# EAGLE schematic Power Outlet-RevB (EAGLE 6.4)
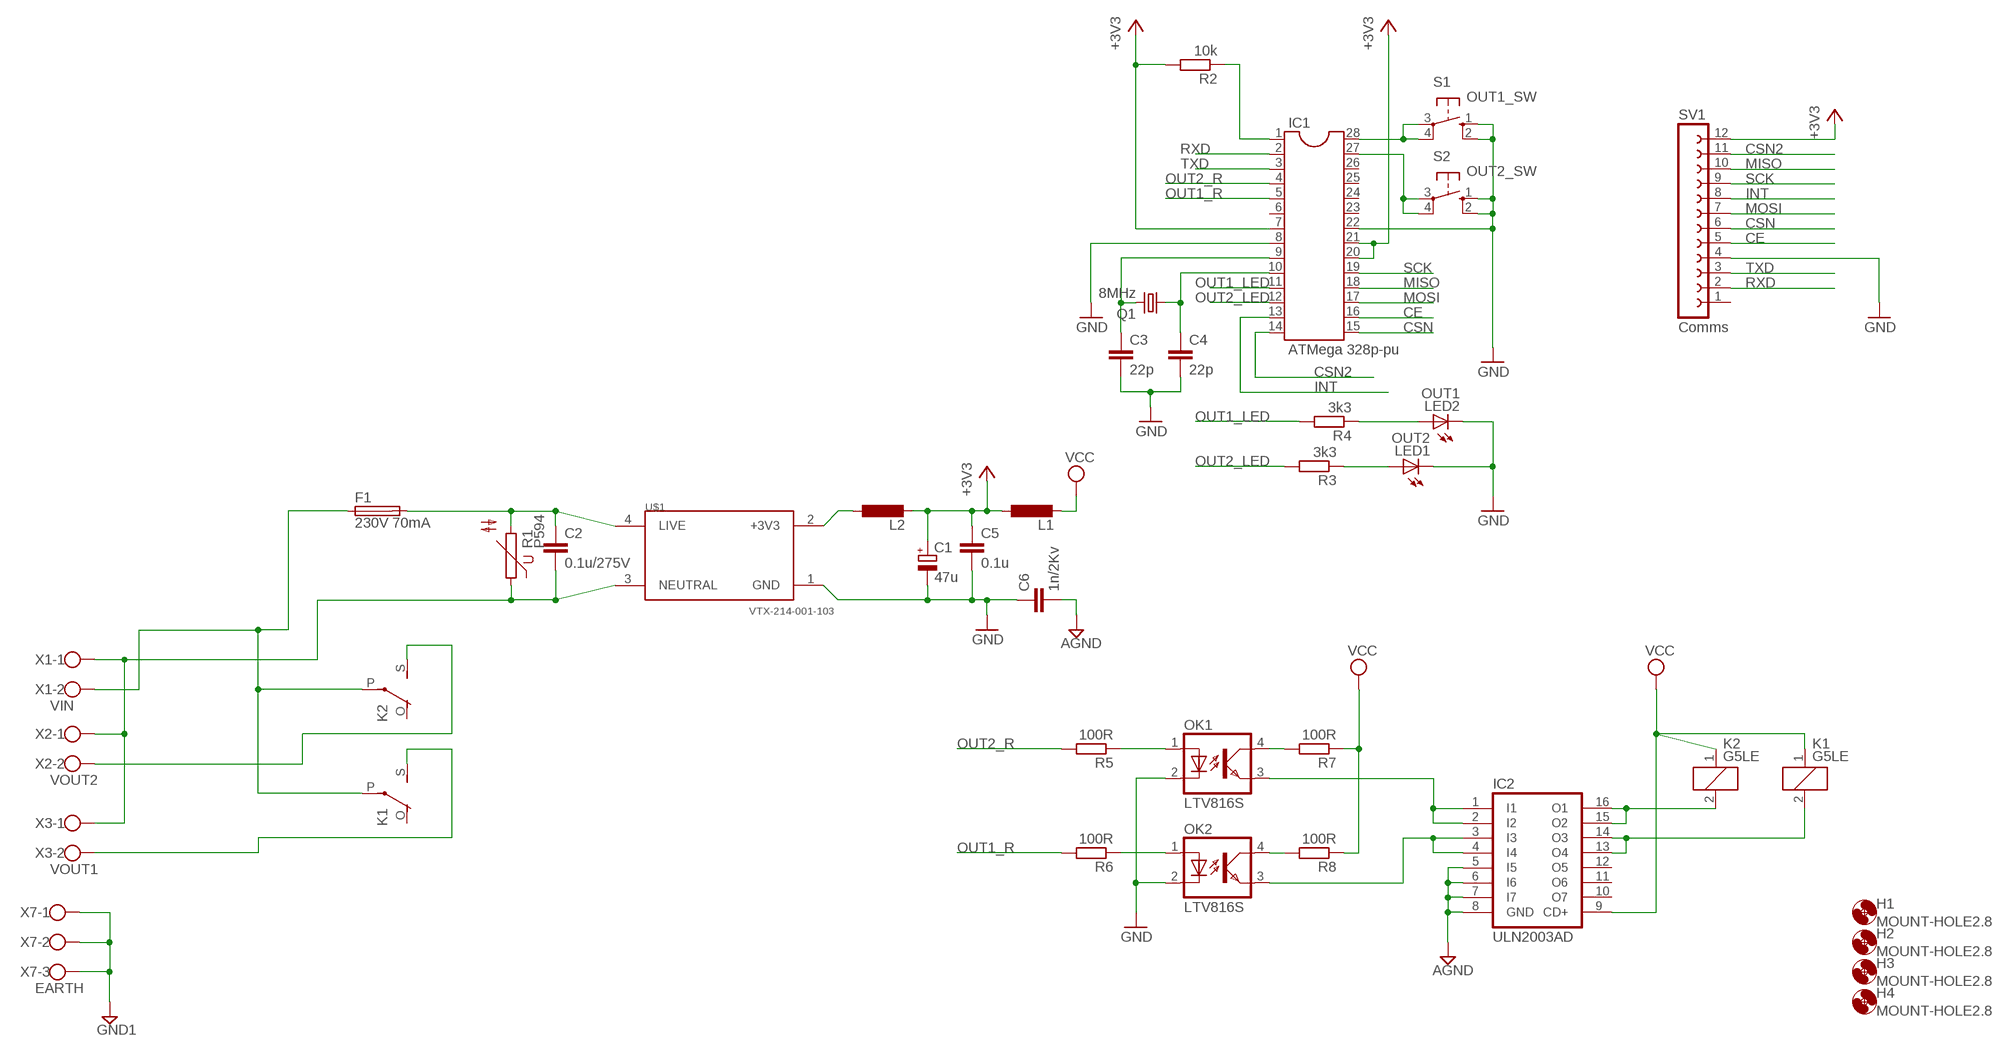
[diagram p0: schematic, sheet 1]

## Parts
C1  47u  CPOL-EUE2,5-6E  [E2,5-6E]
C2  0.1u/275V  C-EU050-030X075  [C050-030X075]
C3  22p  C-EUC1206K  [C1206K]
C4  22p  C-EUC1206K  [C1206K]
C5  0.1u  C-EUC1206K  [C1206K]
C6  1n/2Kv  C-EUC1206K  [C1206K]
F1  230V 70mA  FUSESH22,5A  [SH22,5A]
H1  MOUNT-HOLE2.8  [2,8]
H2  MOUNT-HOLE2.8  [2,8]
H3  MOUNT-HOLE2.8  [2,8]
H4  MOUNT-HOLE2.8  [2,8]
IC1  ATMega 328p-pu  DIL28-3  [DIL28-3]
IC2  ULN2003AD  [SO16]
K1  G5LE  [G5LE]
K2  G5LE  [G5LE]
L1  L-EUL3225P  [L3225P]
L2  L-EUL3225P  [L3225P]
LED1  OUT2  LED5MM  [LED5MM]
LED2  OUT1  LED5MM  [LED5MM]
OK1  LTV816S  [SMD4]
OK2  LTV816S  [SMD4]
Q1  8MHz  CRYSTALHC49S  [HC49/S]
R1  P594  [P594]
R2  10k  R-EU_R1206W  [R1206W]
R3  3k3  R-EU_R1206W  [R1206W]
R4  3k3  R-EU_R1206W  [R1206W]
R5  100R  R-EU_R1206W  [R1206W]
R6  100R  R-EU_R1206W  [R1206W]
R7  100R  R-EU_R1206W  [R1206W]
R8  100R  R-EU_R1206W  [R1206W]
S1  OUT1_SW  40-XX  [B3F-40XX]
S2  OUT2_SW  40-XX  [B3F-40XX]
SV1  Comms  FE12W  [FE12W]
U$1  VTX-214-001-103  [VTX214001103]
X1  VIN  W237-102  [W237-102]
X2  VOUT2  W237-102  [W237-102]
X3  VOUT1  W237-102  [W237-102]
X7  EARTH  W237-103  [W237-103]

## Nets
+3V3: C1.+ C5.1 IC1.7 IC1.20 IC1.21 L1.1 L2.1 L2.2 R2.2 SV1.12 U$1.2(+3V3)
AGND: C6.2 IC2.5(I5) IC2.6(I6) IC2.7(I7) IC2.8(GND)
CE: IC1.16 SV1.5
CSN: IC1.15 SV1.6
CSN2: IC1.14 SV1.11
GND: C1.- C3.2 C4.2 C5.2 C6.1 IC1.8 IC1.22 LED1.K(C) LED2.K(C) OK1.2(C) OK2.2(C) S1.1(S) S1.2(S1) S2.1(S) S2.2(S1) SV1.4 U$1.1(GND)
GND1: X7.1 X7.2 X7.3
INT: IC1.13 SV1.8
MISO: IC1.18 SV1.10
MOSI: IC1.17 SV1.7
N$1: F1.1 K1.P(2:P) K2.P(2:P) X1.2
N$2: C2.1 F1.2 R1.2 U$1.4(LIVE)
N$3: C2.2 R1.1 U$1.3(NEUTRAL) X1.1 X2.1 X3.1
N$4: IC1.1 R2.1
N$5: C3.1 IC1.9 Q1.2
N$6: C4.1 IC1.10 Q1.1
N$7: LED1.A R3.1
N$8: LED2.A R4.1
N$9: IC1.28 S1.3(P) S1.4(P1)
N$10: IC1.27 S2.3(P) S2.4(P1)
N$11: K2.S(2:S) X2.2
N$12: IC2.15(O2) IC2.16(O1) K2.2
N$13: IC2.13(O4) IC2.14(O3) K1.2
N$14: K1.S(2:S) X3.2
N$15: OK1.1(A) R5.1
N$16: OK2.1(A) R6.1
N$17: IC2.1(I1) IC2.2(I2) OK1.3(EMIT)
N$18: IC2.3(I3) IC2.4(I4) OK2.3(EMIT)
N$19: OK1.4(COL) R7.2
N$20: OK2.4(COL) R8.2
OUT1_LED: IC1.11 R4.2
OUT1_R: IC1.5 R6.2
OUT2_LED: IC1.12 R3.2
OUT2_R: IC1.4 R5.2
RXD: IC1.2 SV1.2
SCK: IC1.19 SV1.9
TXD: IC1.3 SV1.3
VCC: IC2.9(CD+) K1.1 K2.1 L1.2 R7.1 R8.1
Unconnected: IC1.6 IC1.23 IC1.24 IC1.25 IC1.26 IC2.10(O7) IC2.11(O6) IC2.12(O5) K1.O(2:O) K2.O(2:O) SV1.1

## Library data of the parts
C1 = rcl:CPOL-EU: POLARIZED CAPACITOR, European symbol
C2-C6 = rcl:C-EU: CAPACITOR, European symbol
F1 = fuse:FUSE: Fuse; OC_FARNELL: unknown; OC_NEWARK: unknown
H1-H4 = holes:MOUNT-HOLE: MOUNTING HOLE with drill center marker
IC1 = ic-package:DIL28: Dual In Line
IC2 = uln-udn:ULN2003A: DRIVER ARRAY
K1 K2 = relay:G5LE: RELAY 1 x switch, 10 A/120 V AC, 8 A/30 V DC, Omron; OC_FARNELL: unknown; OC_NEWARK: unknown
L1 L2 = rcl:L-EU: INDUCTOR, European symbol
LED1 LED2 = led:LED: LED OSRAM: - CHIPLED LG R971, LG N971, LY N971, LG Q971, LY Q971, LO R971, LY R971 LH N974, LH R974 LS Q976, LO Q976, LY Q976 LO Q996 - Hyper CHIPLED LW Q18S LB Q993, LB Q99A, LB R99A - SideLED LS A670, LO A670, LY A670, LG A670, LP A670 LB A673, LV A673, LT A673, LW A673 LH A674 LY A675 LS A676, LA A676, LO A676, LY A676, LW A676 LS A679, LY A679, LG A679 - Hyper Micro SIDELED® LS Y876, LA Y876, LO Y876, LY Y876 LT Y87S - SmartLED LW L88C, LW L88S LB L89C, LB L89S, LG L890 LS L89K, LO L89K, LY L89K LS L896, LA L896, LO L896, LY L896 - TOPLED LS T670, LO T670, LY T670, LG T670, LP T670 LSG T670, LSP T670, LSY T670, LOP T670, LYG T670 LG T671, LOG T671, LSG T671 LB T673, LV T673, LT T673, LW T673 LH T674 LS T676, LA T676, LO T676, LY T676, LB T676, LH T676, LSB T676, LW T676 LB T67C, LV T67C, LT T67C, LS T67K, LO T67K, LY T67K, LW E67C LS E67B, LA E67B, LO E67B, LY E67B, LB E67C, LV E67C, LT E67C LW T67C LS T679, LY T679, LG T679 LS T770, LO T770, LY T770, LG T770, LP T770 LB T773, LV T773, LT T773, LW T773 LH T774 LS E675, LA E675, LY E675, LS T675 LS T776, LA T776, LO T776, LY T776, LB T776 LHGB T686 LT T68C, LB T68C - Hyper Mini TOPLED® LB M676 - Mini TOPLED Santana® LG M470 LS M47K, LO M47K, LY M47K Source: http://www.osram.convergy.de LUXEON: - LUMILED® LXK2-PW12-R00, LXK2-PW12-S00, LXK2-PW14-U00, LXK2-PW14-V00 LXK2-PM12-R00, LXK2-PM12-S00, LXK2-PM14-U00 LXK2-PE12-Q00, LXK2-PE12-R00, LXK2-PE12-S00, LXK2-PE14-T00, LXK2-PE14-U00 LXK2-PB12-K00, LXK2-PB12-L00, LXK2-PB12-M00, LXK2-PB14-N00, LXK2-PB14-P00, LXK2-PB14-Q00 LXK2-PR12-L00, LXK2-PR12-M00, LXK2-PR14-Q00, LXK2-PR14-R00 LXK2-PD12-Q00, LXK2-PD12-R00, LXK2-PD12-S00 LXK2-PH12-R00, LXK2-PH12-S00 LXK2-PL12-P00, LXK2-PL12-Q00, LXK2-PL12-R00 Source: www.luxeon.com KINGBRIGHT: KA-3528ASYC Source: www.kingbright.com
OK1 OK2 = optocoupler:LTV816: OPTO COUPLER Source: LITEON, LTV816.pdf; OC_FARNELL: unknown; OC_NEWARK: unknown
Q1 = crystal:CRYSTAL: CRYSTAL; OC_FARNELL: 1667008; OC_NEWARK: unknown
R1 = varistor:P594: VARISTOR
R2-R8 = rcl:R-EU_: RESISTOR, European symbol
S1 S2 = switch-omron:40-XX: OMRON SWITCH; MF: OMRON COMPONENTS USA; MPN: B3F-4000; OC_FARNELL: 176434; OC_NEWARK: 36K3105
SV1 = con-lsta:FE12W: FEMALE HEADER; OC_FARNELL: unknown; OC_NEWARK: unknown
U$1 = VTX214001103:VTX-214-001-103
X1-X3 = con-wago-500:W237-102: WAGO SCREW CLAMP; MPN: 237-102; OC_FARNELL: unknown; OC_NEWARK: 70K9898
X7 = con-wago-500:W237-103: WAGO SCREW CLAMP; MPN: 237-103; OC_FARNELL: unknown; OC_NEWARK: 18M7116